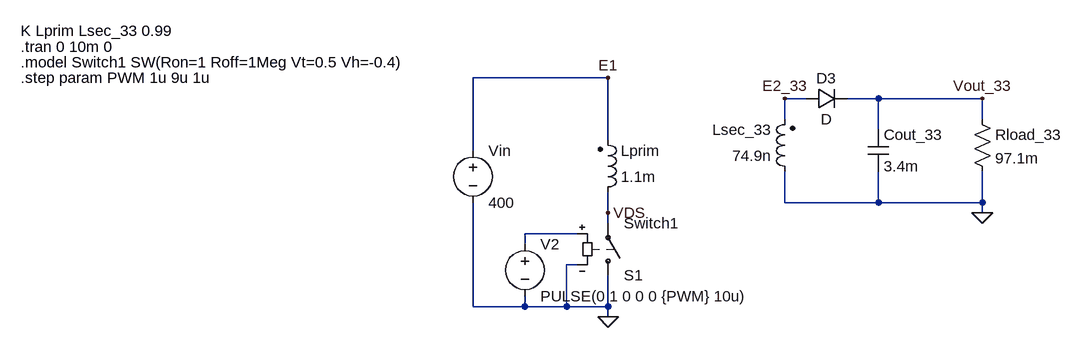
[diagram p0: schematic flyback single no controlled.asc]
flyback single no controlled.asc, the LTspice schematic file:
Version 4
SHEET 1 916 1024
WIRE -272 160 -480 160
WIRE 32 192 0 192
WIRE 144 192 96 192
WIRE 304 192 144 192
WIRE 0 224 0 192
WIRE 304 224 304 192
WIRE 144 240 144 192
WIRE -272 256 -272 160
WIRE -480 272 -480 160
WIRE 0 352 0 304
WIRE 144 352 144 304
WIRE 144 352 0 352
WIRE 304 352 304 304
WIRE 304 352 144 352
WIRE -272 368 -272 336
WIRE 304 368 304 352
WIRE -272 384 -272 368
WIRE -320 400 -400 400
WIRE -400 416 -400 400
WIRE -320 448 -336 448
WIRE -480 512 -480 352
WIRE -400 512 -400 496
WIRE -400 512 -480 512
WIRE -336 512 -336 448
WIRE -336 512 -400 512
WIRE -272 512 -272 464
WIRE -272 512 -336 512
WIRE -272 528 -272 512
FLAG -272 528 0
FLAG 304 368 0
FLAG -272 160 E1
FLAG 0 192 E2_33
FLAG 304 192 Vout_33
FLAG -272 368 VDS
SYMBOL voltage -480 256 R0
SYMATTR InstName Vin
SYMATTR Value 400
SYMBOL ind2 -288 352 M180
WINDOW 0 36 80 Left 2
WINDOW 3 36 40 Left 2
SYMATTR InstName Lprim
SYMATTR Value 1.1m
SYMATTR Type ind
SYMATTR SpiceLine Rser=1m
SYMBOL ind2 16 320 R180
WINDOW 0 36 80 Left 2
WINDOW 3 36 40 Left 2
SYMATTR InstName Lsec_33
SYMATTR Value 74.9n
SYMATTR Type ind
SYMATTR SpiceLine Rser=1m
SYMBOL sw -272 480 M180
SYMATTR InstName S1
SYMATTR Value Switch1
SYMBOL res 288 208 R0
SYMATTR InstName Rload_33
SYMATTR Value 97.1m
SYMBOL cap 128 240 R0
SYMATTR InstName Cout_33
SYMATTR Value 3.4m
SYMBOL diode 32 208 R270
WINDOW 0 32 32 VTop 2
WINDOW 3 0 32 VBottom 2
SYMATTR InstName D3
SYMBOL voltage -400 400 R0
WINDOW 123 0 0 Left 0
WINDOW 39 0 0 Left 0
SYMATTR InstName V2
SYMATTR Value PULSE(0 1 0 0 0 {PWM} 10u)
TEXT -1176 88 Left 2 !K Lprim Lsec_33 0.99
TEXT -1176 112 Left 2 !.tran 0 10m 0
TEXT -1176 136 Left 2 !.model Switch1 SW(Ron=1 Roff=1Meg Vt=0.5 Vh=-0.4)
TEXT -1176 160 Left 2 !.step param PWM 1u 9u 1u

The netlist it stands for:
* flyback single no controlled.asc
Vin E1 0 400
Lprim VDS E1 1.1m Rser=1m
Lsec_33 0 E2_33 74.9n Rser=1m
S1 0 VDS N001 0 Switch1
Rload_33 Vout_33 0 97.1m
Cout_33 Vout_33 0 3.4m
D3 E2_33 Vout_33 D
V2 N001 0 PULSE(0 1 0 0 0 {PWM} 10u)
.model D D
.lib standard.dio
K Lprim Lsec_33 0.99
.tran 0 10m 0
.model Switch1 SW(Ron=1 Roff=1Meg Vt=0.5 Vh=-0.4)
.step param PWM 1u 9u 1u
.backanno
.end